# EAGLE design testv1 (EAGLE 6.4)
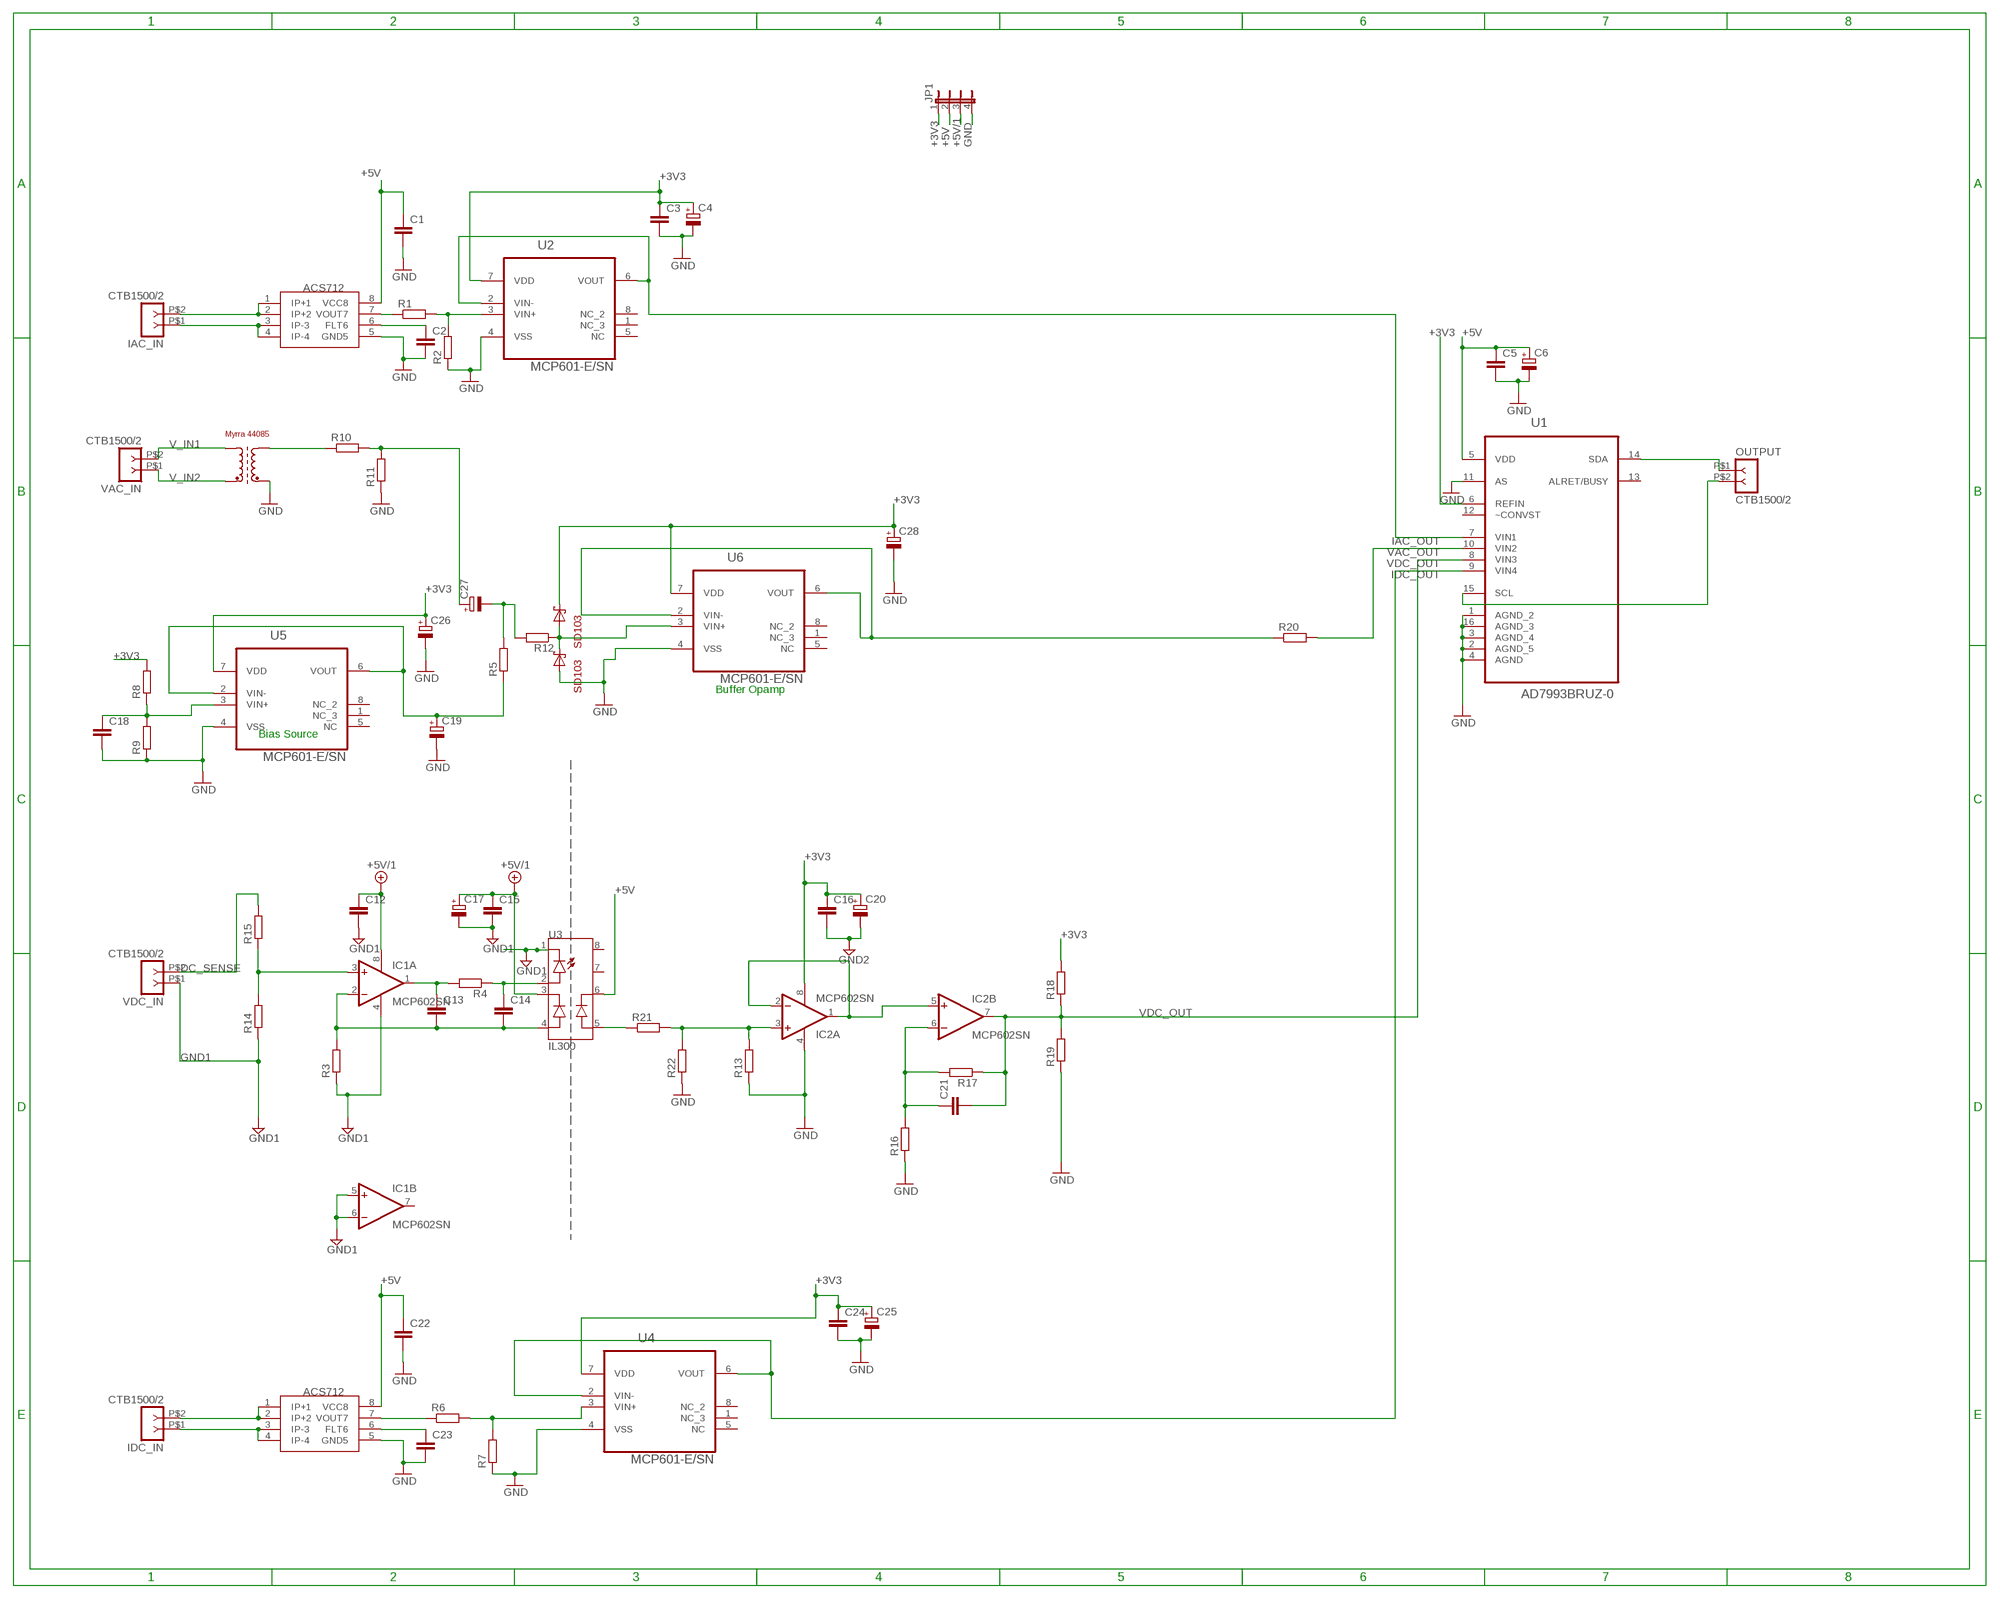
[diagram p0: schematic, sheet 1]

## Parts
C1  C-EU025-025X050  [C025-025X050]
C2  C-EU025-025X050  [C025-025X050]
C3  C-EU025-025X050  [C025-025X050]
C4  CPOL-EUE2-4  [E2-4]
C5  C-EU025-025X050  [C025-025X050]
C6  CPOL-EUE2-4  [E2-4]
C12  C-EU025-025X050  [C025-025X050]
C13  C-EU025-025X050  [C025-025X050]
C14  C-EU025-025X050  [C025-025X050]
C15  C-EU025-025X050  [C025-025X050]
C16  C-EU025-025X050  [C025-025X050]
C17  CPOL-EUE2-4  [E2-4]
C18  C-EU025-025X050  [C025-025X050]
C19  CPOL-EUE2-4  [E2-4]
C20  CPOL-EUE2-4  [E2-4]
C21  C-EU025-025X050  [C025-025X050]
C22  C-EU025-025X050  [C025-025X050]
C23  C-EU025-025X050  [C025-025X050]
C24  C-EU025-025X050  [C025-025X050]
C25  CPOL-EUE2-4  [E2-4]
C26  CPOL-EUE2-4  [E2-4]
C27  CPOL-EUE2-4  [E2-4]
C28  CPOL-EUE2-4  [E2-4]
IAC_IN  CTB1500/2  [CTB1500-2]
IC1  MCP602SN  [SO08]
IC2  MCP602SN  [SO08]
IDC_IN  CTB1500/2  [CTB1500-2]
JP1  JP4E  [JP4]
OUTPUT  CTB1500/2  [CTB1500-2]
R1  R-EU_0207/7  [0207/7]
R2  R-EU_0207/7  [0207/7]
R3  R-EU_0207/7  [0207/7]
R4  R-EU_0207/7  [0207/7]
R5  R-EU_0207/7  [0207/7]
R6  R-EU_0207/7  [0207/7]
R7  R-EU_0207/7  [0207/7]
R8  R-EU_0207/7  [0207/7]
R9  R-EU_0207/7  [0207/7]
R10  R-EU_0207/7  [0207/7]
R11  R-EU_0207/7  [0207/7]
R12  R-EU_0207/7  [0207/7]
R13  R-EU_0207/7  [0207/7]
R14  R-EU_0207/7  [0207/7]
R15  R-EU_0207/7  [0207/7]
R16  R-EU_0207/7  [0207/7]
R17  R-EU_0207/7  [0207/7]
R18  R-EU_0207/7  [0207/7]
R19  R-EU_0207/7  [0207/7]
R20  R-EU_0207/7  [0207/7]
R21  R-EU_0207/7  [0207/7]
R22  R-EU_0207/7  [0207/7]
U1  AD7993BRUZ-0  [SOP65P640X120-16N]
U2  MCP601-E/SN  [SOIC127P600X175-8N]
U3  IL300  [SO8]
U4  MCP601-E/SN  [SOIC127P600X175-8N]
U5  MCP601-E/SN  [SOIC127P600X175-8N]
U6  MCP601-E/SN  [SOIC127P600X175-8N]
U$1  ACS712  [SOIC8]
U$6  MYRRA_4408  [4408]
U$7  SD103A  [D035-10]
U$8  SD103A  [D035-10]
U$10  ACS712  [SOIC8]
VAC_IN  CTB1500/2  [CTB1500-2]
VDC_IN  CTB1500/2  [CTB1500-2]

## Nets
+3V3: C3.1 C4.+ C16.1 C20.+ C24.1 C25.+ C26.+ C28.+ IC2.8(P:V+) JP1.1 R8.2 R18.2 U1.6(REFIN) U2.7(VDD) U4.7(VDD) U5.7(VDD) U6.7(VDD) U$7.C
+5V: C1.1 C5.1 C6.+ C22.1 JP1.2 U1.5(VDD) U3.6(C_OUT) U$1.8(VCC8) U$10.8(VCC8)
+5V/1: C12.1 C15.1 C17.+ IC1.8(P:V+) JP1.3 U3.3(C_FB)
DC_SENSE: R15.2 VDC_IN.P$2
GND: C1.2 C2.2 C3.2 C4.- C5.2 C6.- C18.2 C19.- C22.2 C23.2 C24.2 C25.- C26.- C28.- IC2.4(P:V-) JP1.4 R2.1 R7.1 R9.1 R11.1 R13.1 R16.1 R19.1 R22.1 U1.1(AGND_2) U1.2(AGND_5) U1.3(AGND_4) U1.4(AGND) U1.11(AS) U1.16(AGND_3) U2.4(VSS) U4.4(VSS) U5.4(VSS) U6.4(VSS) U$1.5(GND5) U$6.PIN9(E2) U$8.A U$10.5(GND5)
GND1: C12.2 C15.2 C17.- IC1.4(P:V-) IC1.5(B:+IN) IC1.6(B:-IN) R3.1 R14.1 U3.1(C_LED) VDC_IN.P$1
GND2: C16.2 C20.-
IAC_OUT: U1.7(VIN1) U2.2(VIN-) U2.6(VOUT)
IDC_OUT: U1.9(VIN4) U4.2(VIN-) U4.6(VOUT)
N$1: IAC_IN.P$2 U$1.1(IP+1) U$1.2(IP+2)
N$2: IAC_IN.P$1 U$1.3(IP-3) U$1.4(IP-4)
N$3: R1.1 U$1.7(VOUT7)
N$4: C2.1 U$1.6(FLT6)
N$5: C13.2 C14.2 IC1.2(A:-IN) R3.2 U3.4(A_FB)
N$6: R1.2 R2.2 U2.3(VIN+)
N$7: C14.1 R4.1 U3.2(A_LED)
N$8: IDC_IN.P$2 U$10.1(IP+1) U$10.2(IP+2)
N$9: C13.1 IC1.1(A:OUT) R4.2
N$10: C18.1 R8.1 R9.2 U5.3(VIN+)
N$11: C19.+ R5.1 U5.2(VIN-) U5.6(VOUT)
N$12: R12.1 U6.3(VIN+) U$7.A U$8.C
N$13: R20.1 U6.2(VIN-) U6.6(VOUT)
N$14: IC2.3(A:+IN) R13.2 R21.2 R22.2
N$15: R21.1 U3.5(A_OUT)
N$17: C27.+ R10.2 R11.2
N$18: R10.1 U$6.PIN7(A2)
N$20: IC2.1(A:OUT) IC2.2(A:-IN) IC2.5(B:+IN)
N$21: C27.- R5.2 R12.2
N$22: C21.1 IC2.6(B:-IN) R16.2 R17.2
N$25: IC1.3(A:+IN) R14.2 R15.1
N$26: IDC_IN.P$1 U$10.3(IP-3) U$10.4(IP-4)
N$27: R6.1 U$10.7(VOUT7)
N$28: C23.1 U$10.6(FLT6)
N$29: R6.2 R7.2 U4.3(VIN+)
N$30: OUTPUT.P$1 U1.14(SDA)
SCL: OUTPUT.P$2 U1.15(SCL)
V_IN1: U$6.PIN5(A1) VAC_IN.P$2
V_IN2: U$6.PIN1(E1) VAC_IN.P$1
VAC_OUT: R20.2 U1.10(VIN2)
VDC_OUT: C21.2 IC2.7(B:OUT) R17.1 R18.1 R19.2 U1.8(VIN3)
Unconnected: IC1.7(B:OUT) U1.12(~CONVST) U1.13(ALRET/BUSY) U2.1(NC_3) U2.5(NC) U2.8(NC_2) U3.7(PIN7) U3.8(PIN8) U4.1(NC_3) U4.5(NC) U4.8(NC_2) U5.1(NC_3) U5.5(NC) U5.8(NC_2) U6.1(NC_3) U6.5(NC) U6.8(NC_2)

## Notes on the sheet
- Buffer Opamp
- Bias Source

## Library data of the parts
C1-C3 C5 C12-C16 C18 C21-C24 = resistor:C-EU: CAPACITOR, European symbol
C4 C6 C17 C19 C20 C25-C28 = resistor:CPOL-EU: POLARIZED CAPACITOR, European symbol
IAC_IN IDC_IN OUTPUT VAC_IN VDC_IN = eko-parts:CTB1500/2
IC1 IC2 = linear:MCP602: Single Op Amp 2.7V to 6.0V Single Supply CMOS Source: http://ww1.microchip.com/downloads/en/DeviceDoc/21314g.pdf
JP1 = jumper:JP4E: JUMPER
R1-R22 = resistor:R-EU_: RESISTOR, European symbol
U1 = ADC:AD7993BRUZ-0: ADC; MPN: AD7993BRUZ-0; OC_FARNELL: 1078309; OC_NEWARK: 59K6101; PACKAGE: TSSOP-16; SUPPLIER: Analog Devices
U2 U4-U6 = mcp:MCP601-E/SN: IC, 2.7V to 5.5V Single-Supply CMOS Single Op Amps,SOIC-8; MPN: MCP601-E/SN; OC_FARNELL: 1852039; OC_NEWARK: 88H9865; PACKAGE: SOIC-8; SUPPLIER: Microchip
U3 = eko-parts:IL300
U$1 U$10 = Pauls_parts:ACS712
U$6 = Pauls_parts:MYRRA_4408
U$7 U$8 = Pauls_parts:SD103A

## Board
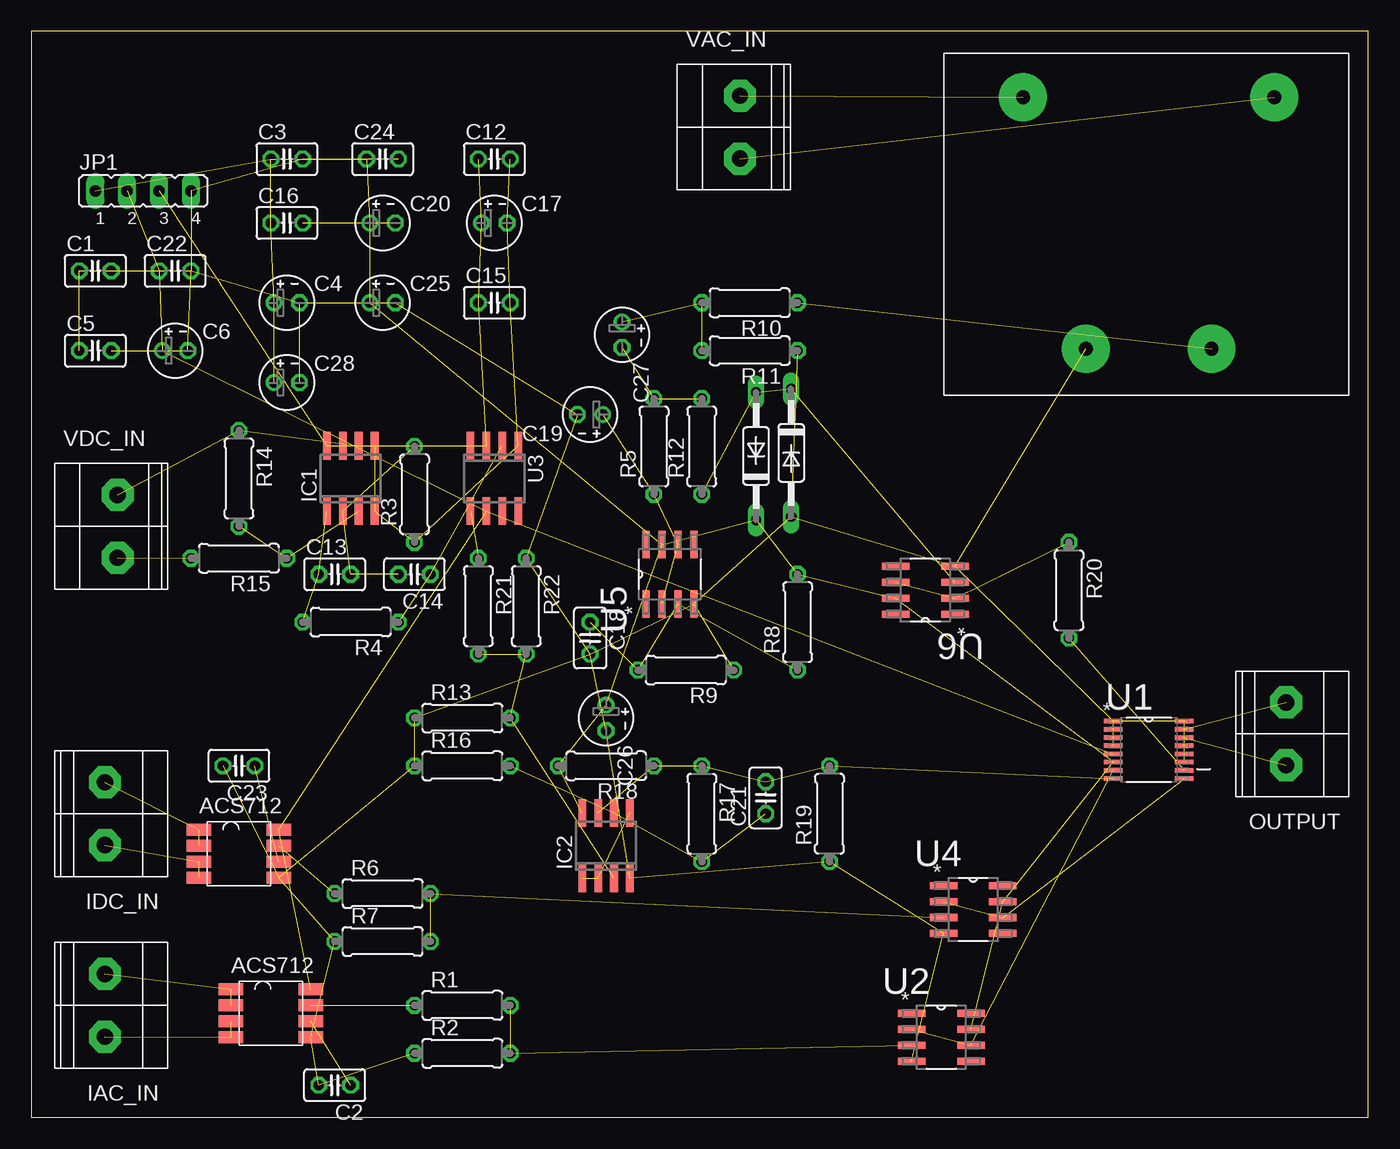
[diagram p1: board, top side]
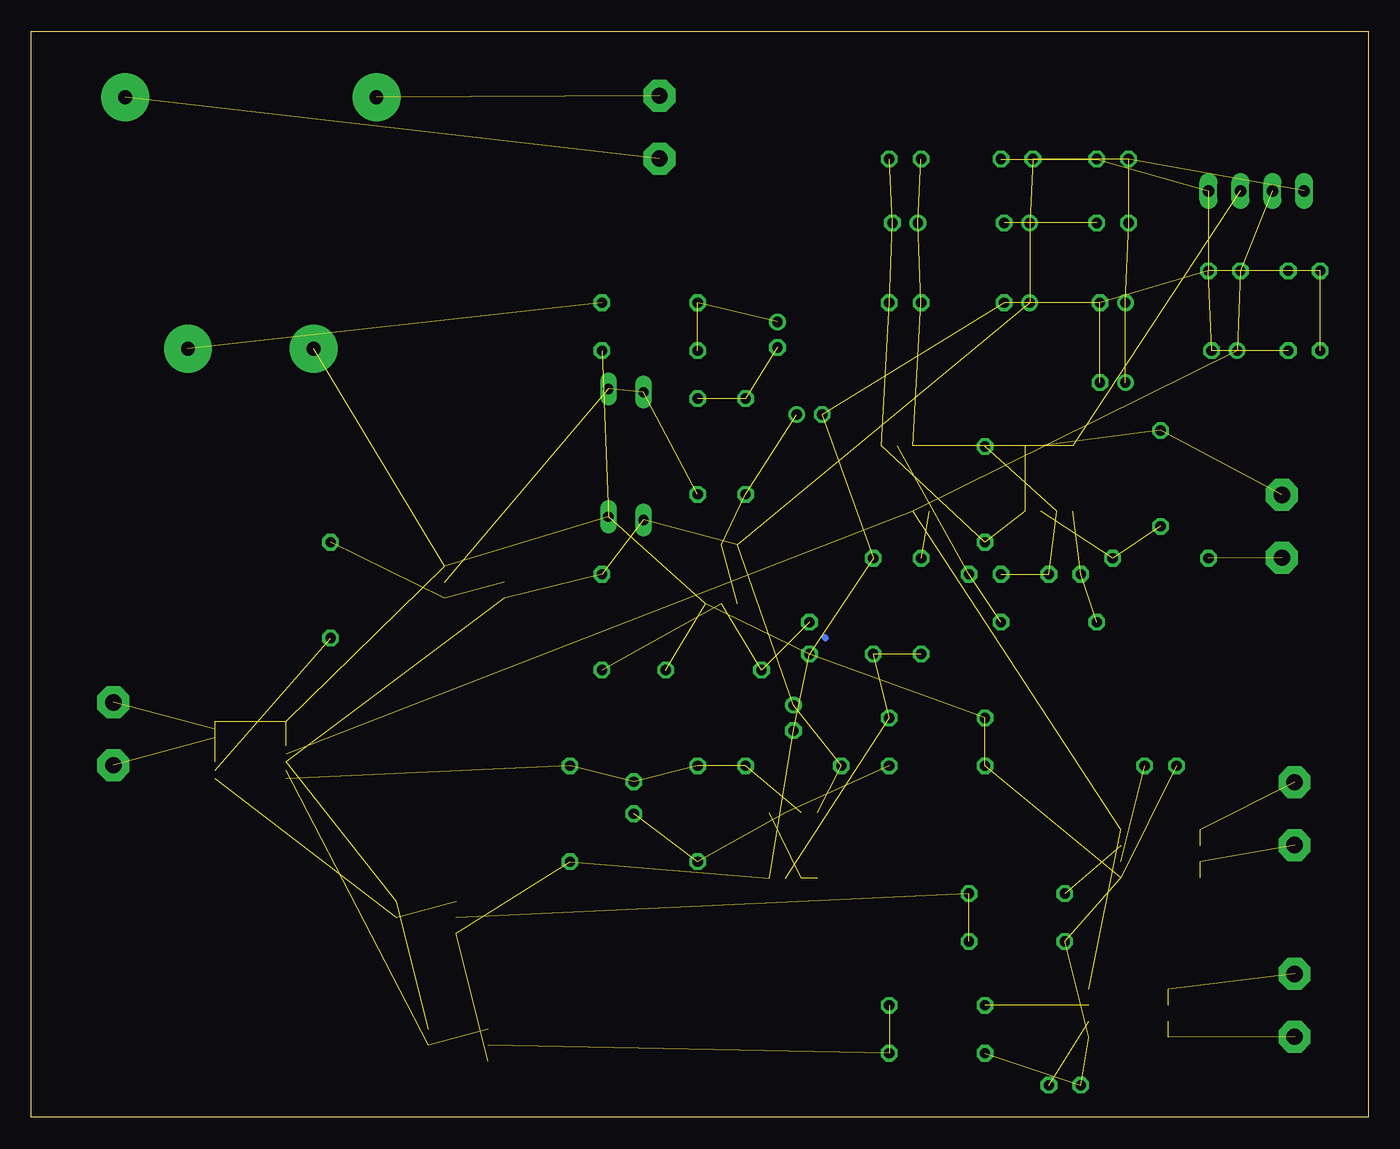
[diagram p2: board, bottom side, seen from below]

Size 106.35 x 86.35 mm. Coordinates in mm from the lower left corner, seen from the top.
Outline: 0,0 106.35,0 106.35,86.35 0,86.35 0,0
Copper layers (1*16): Top 0.035mm / dielectric 1.5mm / Bottom 0.035mm
Design rules "default": minimum track width 10mil, minimum drill 24mil, track to track 8mil, track to pad 8mil, pad to pad 8mil, via to via 8mil, smd to smd 8mil, copper to edge 40mil, drill to drill 8mil, minimum pad ring 10mil, minimum via ring 8mil, stop-mask expansion 4mil, vias tented up to drill 0mil, thermal gap 10mil

### Footprints (pad centres in the part's own frame; a part is rotated, then mirrored left to right if it is on the bottom)
C025-025X050 = drill 0.813 octagon: 1 -1.27,0; 2 1.27,0
E2-4 = drill 0.813 pad 1.27: + -1.016,0 | drill 0.813 pad 1.27 octagon: - 1.016,0
CTB1500-2 = drill 1.3 pad 2.54 octagon: P$1 -2.5,0.5; P$2 2.5,0.5
SO08 = smd 0.6 x 2.2: 1 -1.905,-2.6; 2 -0.635,-2.6; 3 0.635,-2.6; 4 1.905,-2.6; 5 1.905,2.6; 6 0.635,2.6; 7 -0.635,2.6; 8 -1.905,2.6
JP4 = drill 0.914 long: 1 -3.81,0; 2 -1.27,0; 3 1.27,0; 4 3.81,0
0207/7 = drill 0.813 octagon: 1 -3.81,0; 2 3.81,0
SOP65P640X120-16N = smd 1.473 x 0.356: 1 -2.819,2.286; 2 -2.819,1.626; 3 -2.819,0.965; 4 -2.819,0.33; 5 -2.819,-0.33; 6 -2.819,-0.965; 7 -2.819,-1.626; 8 -2.819,-2.286; 9 2.819,-2.286; 10 2.819,-1.626; 11 2.819,-0.965; 12 2.819,-0.33; 13 2.819,0.33; 14 2.819,0.965; 15 2.819,1.626; 16 2.819,2.286
SOIC127P600X175-8N = smd 2.184 x 0.559: 1 -2.362,1.905; 2 -2.362,0.635; 3 -2.362,-0.635; 4 -2.362,-1.905; 5 2.362,-1.905; 6 2.362,-0.635; 7 2.362,0.635; 8 2.362,1.905
SO8 = smd 0.6 x 2.2: 1 -1.905,-2.6; 2 -0.635,-2.6; 3 0.635,-2.6; 4 1.905,-2.6; 5 1.905,2.6; 6 0.635,2.6; 7 -0.635,2.6; 8 -1.905,2.6
SOIC8 = smd 1.93 x 0.965: 1 -4.445,1.27; 2 -4.445,0; 3 -4.445,-1.27; 4 -4.445,-2.54; 5 1.905,-2.54; 6 1.905,-1.27; 7 1.905,0; 8 1.905,1.27
4408 = drill 1.1 pad 3.81: PIN1 -10,10; PIN5 10,10; PIN7 5,-10; PIN9 -5,-10
D035-10 = drill 0.813 long: A 4.318,0.762; C -5.842,0.762

### Placement (x,y rotation side)
C1  5.08,67.31 0 top
C2  24.13,2.54 180 top
C3  20.32,76.2 0 top
C4  20.32,64.77 0 top
C5  5.08,60.96 0 top
C6  11.43,60.96 0 top
C12  36.83,76.2 0 top
C13  24.13,43.18 0 top
C14  30.48,43.18 180 top
C15  36.83,64.77 0 top
C16  20.32,71.12 0 top
C17  36.83,71.12 0 top
C18  44.45,38.1 270 top
C19  44.45,55.88 180 top
C20  27.94,71.12 0 top
C21  58.42,25.4 90 top
C22  11.43,67.31 0 top
C23  16.51,27.94 180 top
C24  27.94,76.2 0 top
C25  27.94,64.77 0 top
C26  45.72,31.75 270 top
C27  46.99,62.23 270 top
C28  20.32,58.42 0 top
IAC_IN  6.35,8.89 90 top
IC1  25.4,50.8 0 top
IC2  45.72,21.59 0 top
IDC_IN  6.35,24.13 90 top
JP1  8.89,73.66 0 top
OUTPUT  100.33,30.48 90 top
R1  34.29,8.89 0 top
R2  34.29,5.08 0 top
R3  30.48,49.53 90 top
R4  25.4,39.37 180 top
R5  49.53,53.34 90 top
R6  27.94,17.78 0 top
R7  27.94,13.97 0 top
R8  60.96,39.37 90 top
R9  52.07,35.56 180 top
R10  57.15,64.77 180 top
R11  57.15,60.96 180 top
R12  53.34,53.34 90 top
R13  34.29,31.75 0 top
R14  16.51,50.8 270 top
R15  16.51,44.45 180 top
R16  34.29,27.94 0 top
R17  53.34,24.13 270 top
R18  45.72,27.94 180 top
R19  63.5,24.13 90 top
R20  82.55,41.91 270 top
R21  35.56,40.64 270 top
R22  39.37,40.64 270 top
U1  88.9,29.21 0 top
U2  72.39,6.35 0 top
U3  36.83,50.8 180 top
U4  74.93,16.51 0 top
U5  50.8,43.18 90 top
U6  71.12,41.91 180 top
U$1  20.32,8.89 0 top
U$6  88.9,71.12 0 top
U$7  58.42,53.34 90 top
U$8  59.69,52.07 270 top
U$10  17.78,21.59 0 top
VAC_IN  55.88,78.74 270 top
VDC_IN  6.35,46.99 270 top

### Tracks (layer width: path | path; a pad name or v marks a point on that pad's centre or on a via)
+3V3  (17 unrouted)
+5V  (8 unrouted)
+5V/1  (5 unrouted)
DC_SENSE  (1 unrouted)
GND  (37 unrouted)
GND1  (9 unrouted)
GND2  (1 unrouted)
IAC_OUT  (2 unrouted)
IDC_OUT  (2 unrouted)
N$1  (2 unrouted)
N$2  (2 unrouted)
N$3  (1 unrouted)
N$4  (1 unrouted)
N$5  (4 unrouted)
N$6  (2 unrouted)
N$7  (2 unrouted)
N$8  (2 unrouted)
N$9  (2 unrouted)
N$10  (3 unrouted)
N$11  (3 unrouted)
N$12  (3 unrouted)
N$13  (2 unrouted)
N$14  (3 unrouted)
N$15  (1 unrouted)
N$16
  Bottom 0.508: 43.18,38.1 43.23,38.15
N$17  (2 unrouted)
N$18  (1 unrouted)
N$20  (2 unrouted)
N$21  (2 unrouted)
N$22  (3 unrouted)
N$25  (2 unrouted)
N$26  (2 unrouted)
N$27  (1 unrouted)
N$28  (1 unrouted)
N$29  (2 unrouted)
N$30  (1 unrouted)
SCL  (1 unrouted)
V_IN1  (1 unrouted)
V_IN2  (1 unrouted)
VAC_OUT  (1 unrouted)
VDC_OUT  (5 unrouted)